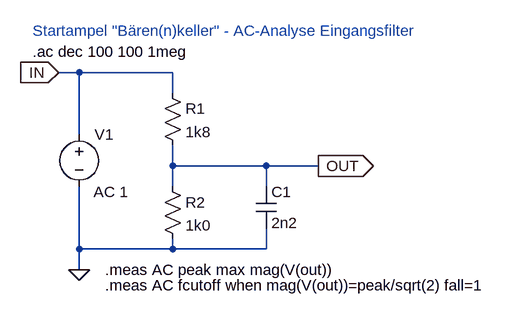
[diagram p0: schematic Filter_cutoff-frequency.asc]
Filter_cutoff-frequency.asc, the LTspice schematic file:
Version 4
SHEET 1 880 680
WIRE -144 -16 -176 -16
WIRE 0 -16 -144 -16
WIRE 0 16 0 -16
WIRE -144 80 -144 -16
WIRE 0 128 0 96
WIRE 144 128 0 128
WIRE 224 128 144 128
WIRE 0 160 0 128
WIRE 144 160 144 128
WIRE -144 256 -144 160
WIRE 0 256 0 240
WIRE 0 256 -144 256
WIRE 144 256 144 224
WIRE 144 256 0 256
WIRE -144 288 -144 256
FLAG 224 128 OUT
IOPIN 224 128 Out
FLAG -176 -16 IN
IOPIN -176 -16 In
FLAG -144 288 0
SYMBOL cap 128 160 R0
SYMATTR InstName C1
SYMATTR Value 2n2
SYMBOL voltage -144 64 R0
WINDOW 3 22 128 Left 2
WINDOW 123 22 104 Left 2
WINDOW 39 0 0 Left 0
SYMATTR Value ""
SYMATTR Value2 AC 1
SYMATTR InstName V1
SYMBOL res -16 0 R0
SYMATTR InstName R1
SYMATTR Value 1k8
SYMBOL res -16 144 R0
SYMATTR InstName R2
SYMATTR Value 1k0
TEXT -216 -48 Left 2 !.ac dec 100 100 1meg
TEXT -104 288 Left 2 !.meas AC peak max mag(V(out))
TEXT -104 312 Left 2 !.meas AC fcutoff when mag(V(out))=peak/sqrt(2) fall=1
TEXT -216 -80 Left 2 ;Startampel "Bären(n)keller" - AC-Analyse Eingangsfilter

The netlist it stands for:
* Filter_cutoff-frequency.asc
C1 OUT 0 2n2
V1 IN 0 AC 1
R1 IN OUT 1k8
R2 OUT 0 1k0
.ac dec 100 100 1meg
.meas AC peak max mag(V(out))
.meas AC fcutoff when mag(V(out))=peak/sqrt(2) fall=1
* Startampel "Bären(n)keller" - AC-Analyse Eingangsfilter
.backanno
.end